# EAGLE design ludusProtoShieldWireless (EAGLE 7.2.0)
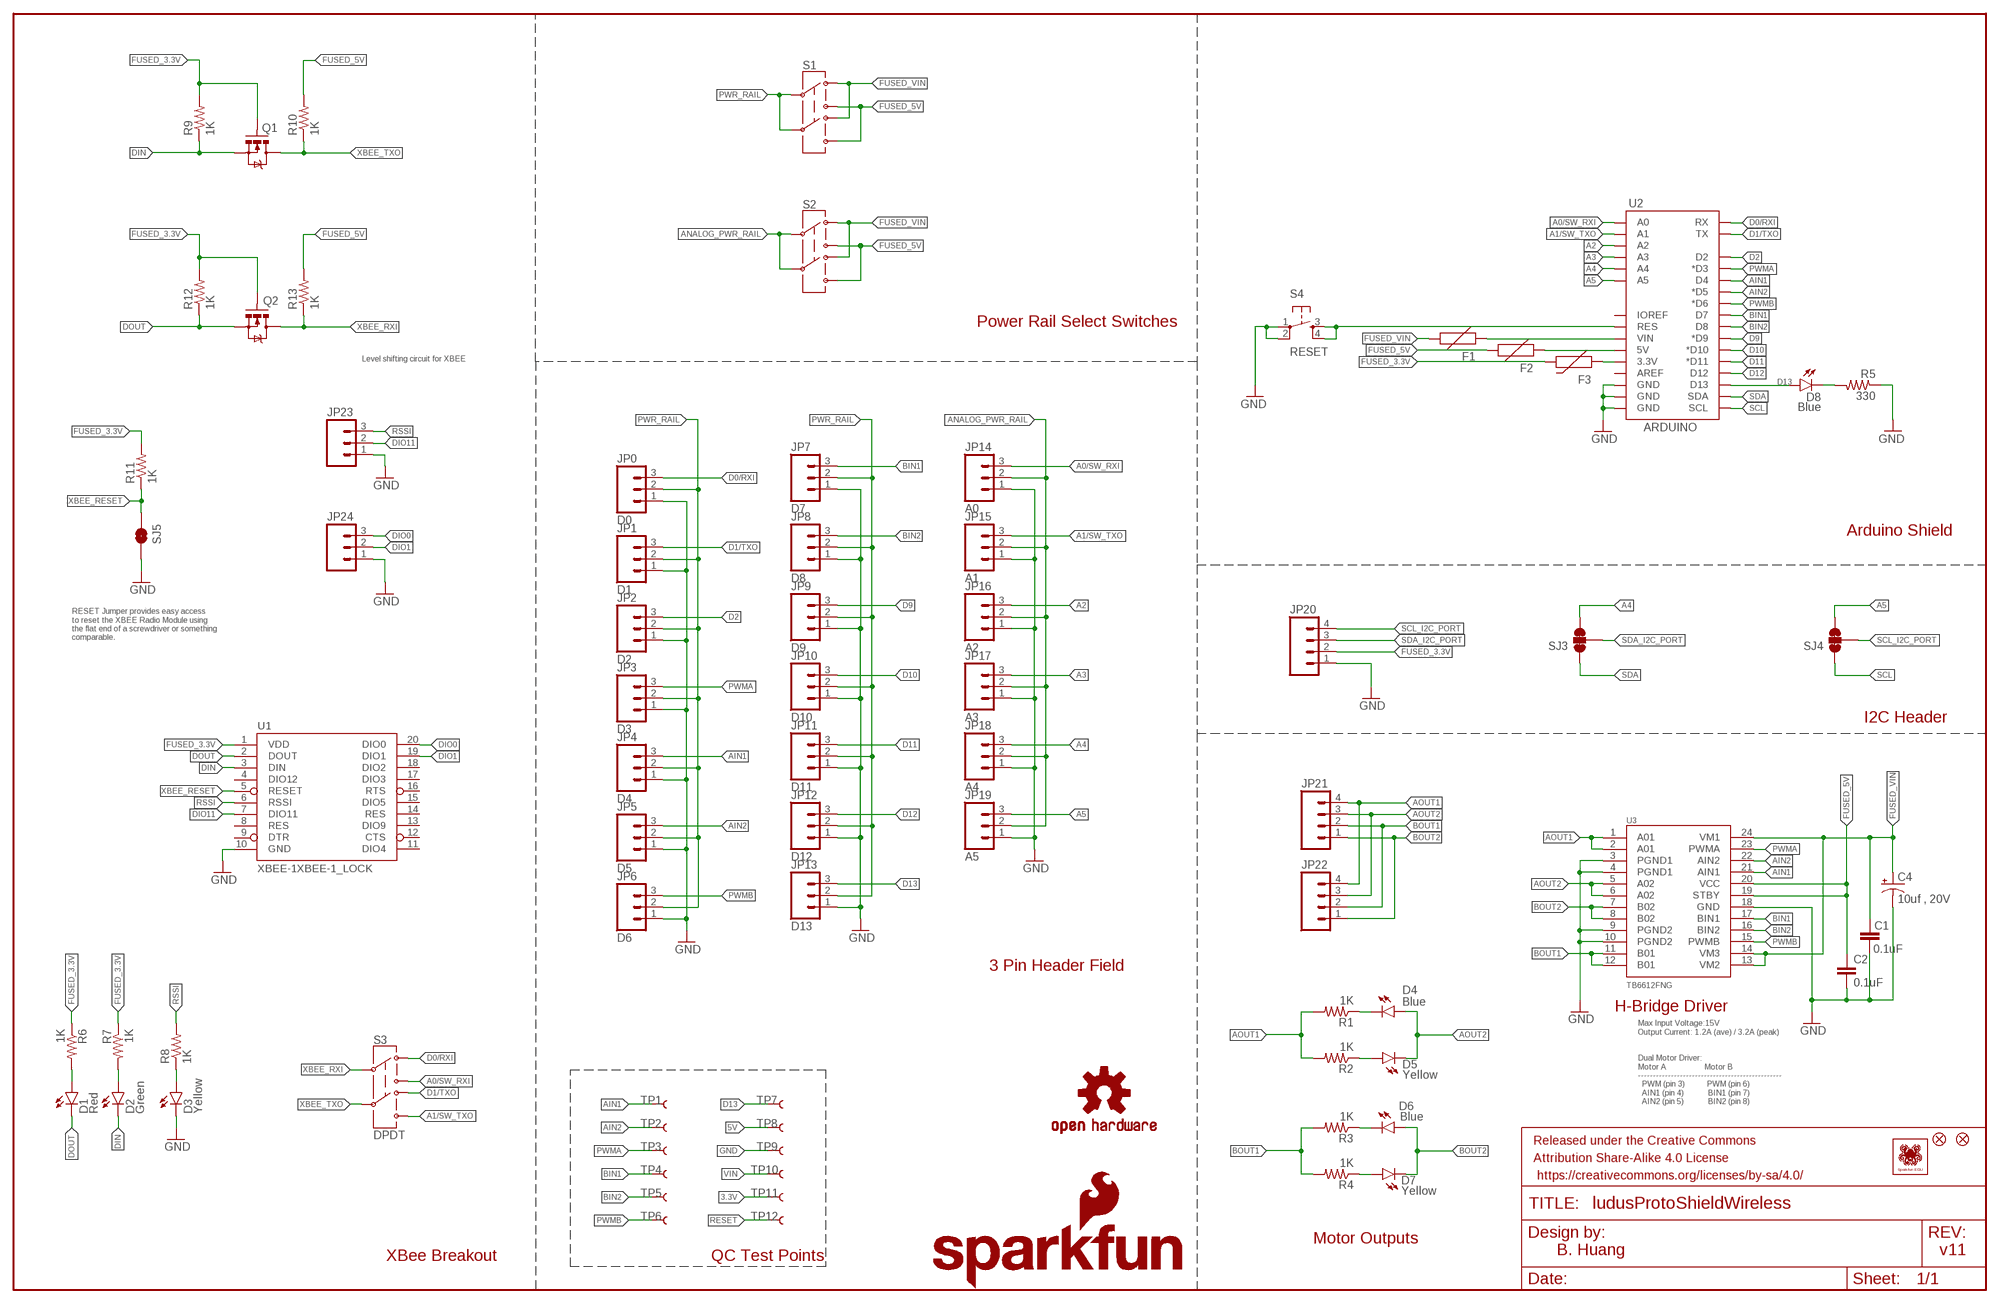
[diagram p0: schematic, sheet 1]

## Parts
C1  0.1uF  0.1UF-25V-5%(0603)  [0603-CAP]
C2  0.1uF  0.1UF-25V-5%(0603)  [0603-CAP]
C4  10uf , 20V  10UF-20V-10%(TANT)  [EIA3528]
D1  Red  LED-RED0603  [LED-0603]
D2  Green  LED-GREEN0603  [LED-0603]
D3  Yellow  LED-YELLOW0603  [LED-0603]
D4  Blue  LED-BLUE0603  [LED-0603]
D5  Yellow  LED-YELLOW0603  [LED-0603]
D6  Blue  LED-BLUE0603  [LED-0603]
D7  Yellow  LED-YELLOW0603  [LED-0603]
D8  Blue  LED-BLUE0603  [LED-0603]
F1  PTCSMD  [PTC-1206]
F2  PTCSMD  [PTC-1206]
F3  PTCSMD  [PTC-1206]
FID1  FIDUCIAL1X2  [FIDUCIAL-1X2]
FID2  FIDUCIAL1X2  [FIDUCIAL-1X2]
FRAME1  FRAME-LEDGER  [CREATIVE_COMMONS]
JP0  D0  M03LOCK  [1X03_LOCK]
JP1  D1  M03LOCK  [1X03_LOCK]
JP2  D2  M03LOCK  [1X03_LOCK]
JP3  D3  M03LOCK  [1X03_LOCK]
JP4  D4  M03LOCK  [1X03_LOCK]
JP5  D5  M03LOCK  [1X03_LOCK]
JP6  D6  M03LOCK  [1X03_LOCK]
JP7  D7  M03LOCK  [1X03_LOCK]
JP8  D8  M03LOCK  [1X03_LOCK]
JP9  D9  M03LOCK  [1X03_LOCK]
JP10  D10  M03LOCK  [1X03_LOCK]
JP11  D11  M03LOCK  [1X03_LOCK]
JP12  D12  M03LOCK  [1X03_LOCK]
JP13  D13  M03LOCK  [1X03_LOCK]
JP14  A0  M03LOCK  [1X03_LOCK]
JP15  A1  M03LOCK  [1X03_LOCK]
JP16  A2  M03LOCK  [1X03_LOCK]
JP17  A3  M03LOCK  [1X03_LOCK]
JP18  A4  M03LOCK  [1X03_LOCK]
JP19  A5  M03LOCK  [1X03_LOCK]
JP20  M04PTH  [1X04]
JP21  M04PTH  [1X04]
JP22  M04LOCK  [1X04_LOCK]
JP23  M031X03_NO_SILK  [1X03_NO_SILK]
JP24  M031X03_NO_SILK  [1X03_NO_SILK]
LOGO1  OSHW-LOGOM  [OSHW-LOGO-M]
LOGO2  SFE_LOGO_NAME_FLAME.1_INCH  [SFE_LOGO_NAME_FLAME_.1]
LOGO3  SFE_LOGO_FLAME.2_INCH  [SFE_LOGO_FLAME_.2]
LOGO4  SFE_LOGO_NAME_FLAME.1_INCH  [SFE_LOGO_NAME_FLAME_.1]
LOGO5  SFE_LOGO_FLAME.2COP  [SFE_LOGO_FLAME_COPPER_.2]
Q1  MOSFET-NCHANNELBSS138  [SOT23-3]
Q2  MOSFET-NCHANNELBSS138  [SOT23-3]
R1  1K  1KOHM-1/10W-1%(0603)  [0603-RES]
R2  1K  1KOHM-1/10W-1%(0603)  [0603-RES]
R3  1K  1KOHM-1/10W-1%(0603)  [0603-RES]
R4  1K  1KOHM-1/10W-1%(0603)  [0603-RES]
R5  330  330OHM1/10W1%(0603)  [0603-RES]
R6  1K  1KOHM-1/10W-1%(0603)  [0603-RES]
R7  1K  1KOHM-1/10W-1%(0603)  [0603-RES]
R8  1K  1KOHM-1/10W-1%(0603)  [0603-RES]
R9  1K  1KOHM-1/10W-1%(0603)  [0603-RES]
R10  1K  1KOHM-1/10W-1%(0603)  [0603-RES]
R11  1K  1KOHM-1/10W-1%(0603)  [0603-RES]
R12  1K  1KOHM-1/10W-1%(0603)  [0603-RES]
R13  1K  1KOHM-1/10W-1%(0603)  [0603-RES]
S1  SWITCH-DPDTAYZ0202  [AYZ0202]
S2  SWITCH-DPDTAYZ0202  [AYZ0202]
S3  DPDT  SWITCH-DPDTAYZ0202  [AYZ0202]
S4  RESET  TAC_SWITCHSMD  [TACTILE-SWITCH-SMD]
SJ3  JUMPER-PAD-3-NC_BY_TRACE  [PAD-JUMPER-3-3OF3_NC_BY_TRACE_YES_SILK_FULL_BOX]
SJ4  JUMPER-PAD-3-NC_BY_TRACE  [PAD-JUMPER-3-3OF3_NC_BY_TRACE_YES_SILK_FULL_BOX]
SJ5  SOLDERJUMPERNO  [SJ_2S-NO]
TP1  TEST-POINT3X5  [PAD.03X.05]
TP2  TEST-POINT3X5  [PAD.03X.05]
TP3  TEST-POINT3X5  [PAD.03X.05]
TP4  TEST-POINT3X5  [PAD.03X.05]
TP5  TEST-POINT3X5  [PAD.03X.05]
TP6  TEST-POINT3X5  [PAD.03X.05]
TP7  TEST-POINT3X5  [PAD.03X.05]
TP8  TEST-POINT3X5  [PAD.03X.05]
TP9  TEST-POINT3X5  [PAD.03X.05]
TP10  TEST-POINT3X5  [PAD.03X.05]
TP11  TEST-POINT3X5  [PAD.03X.05]
TP12  TEST-POINT3X5  [PAD.03X.05]
U1  XBEE-1XBEE-1_LOCK  [XBEE-1_LOCK]
U2  ARDUINO  ARDUINO_R3_SHIELDUNO_R3_SHIELD_NOLABELS_LOCK  [UNO_R3_SHIELD_NOLABELS_LOCK]
U3  TB6612FNG  [SSOP24]
U$1  SFE_LUDUSSFE_LUDUS-M  [SFE_LUDUS-M]

## Nets
3.3V: F3.1 TP11.P$1 U2.3.3V
5V: F2.1 TP8.P$1 U2.5V
A0/SW_RXI: JP14.3 S3.3 U2.A0
A1/SW_TXO: JP15.3 S3.6 U2.A1
A2: JP16.3 U2.A2
A3: JP17.3 U2.A3
A4: JP18.3 SJ3.3 U2.A4
A5: JP19.3 SJ4.3 U2.A5
AIN1: JP4.3 TP1.P$1 U2.D4 U3.21(AIN1)
AIN2: JP5.3 TP2.P$1 U2.D5(*D5) U3.22(AIN2)
ANALOG_PWR_RAIL: JP14.2 JP15.2 JP16.2 JP17.2 JP18.2 JP19.2 S2.2 S2.5
AOUT1: JP21.4 JP22.4 R1.2 R2.2 U3.1(A01) U3.2(A01)
AOUT2: D4.A D5.C JP21.3 JP22.3 U3.5(A02) U3.6(A02)
BIN1: JP7.3 TP4.P$1 U2.D7 U3.17(BIN1)
BIN2: JP8.3 TP5.P$1 U2.D8 U3.16(BIN2)
BOUT1: JP21.2 JP22.2 R3.2 R4.2 U3.11(B01) U3.12(B01)
BOUT2: D6.A D7.C JP21.1 JP22.1 U3.7(B02) U3.8(B02)
D0/RXI: JP0.3 S3.1 U2.RX
D1/TXO: JP1.3 S3.4 U2.TX
D2: JP2.3 U2.D2
D9: JP9.3 U2.D9(*D9)
D10: JP10.3 U2.D10(*D10)
D11: JP11.3 U2.D11(*D11)
D12: JP12.3 U2.D12
D13: D8.A JP13.3 TP7.P$1 U2.D13
DIN: D2.C Q1.2(S) R9.1 U1.3(DIN)
DIO0: JP24.3 U1.20(DIO0)
DIO1: JP24.2 U1.19(DIO1)
DIO11: JP23.2 U1.7(DIO11)
DOUT: D1.C Q2.2(S) R12.1 U1.2(DOUT)
FUSED_3.3V: F3.2 JP20.2 Q1.1(G) Q2.1(G) R6.1 R7.1 R9.2 R11.2 R12.2 U1.1(VDD)
FUSED_5V: C2.1 F2.2 R10.2 R13.2 S1.3 S1.6 S2.3 S2.6 U3.19(STBY) U3.20(VCC)
FUSED_VIN: C1.1 C4.A(+) F1.2 S1.1 S1.4 S2.1 S2.4 U3.13(VM2) U3.14(VM3) U3.24(VM1)
GND: C1.2 C2.2 C4.C(-) D3.C JP0.1 JP1.1 JP2.1 JP3.1 JP4.1 JP5.1 JP6.1 JP7.1 JP8.1 JP9.1 JP10.1 JP11.1 JP12.1 JP13.1 JP14.1 JP15.1 JP16.1 JP17.1 JP18.1 JP19.1 JP20.1 JP23.1 JP24.1 R5.1 S4.1 S4.2 SJ5.2 TP9.P$1 U1.10(GND) U2.GND@0(GND) U2.GND@1(GND) U2.GND@2(GND) U3.3(PGND1) U3.4(PGND1) U3.9(PGND2) U3.10(PGND2) U3.18(GND)
N$1: D8.C R5.2
N$3: D5.A R2.1
N$5: D4.C R1.1
N$8: D7.A R4.1
N$9: D6.C R3.1
N$22: D1.A R6.2
N$43: D2.A R7.2
N$44: D3.A R8.1
PWMA: JP3.3 TP3.P$1 U2.D3(*D3) U3.23(PWMA)
PWMB: JP6.3 TP6.P$1 U2.D6(*D6) U3.15(PWMB)
PWR_RAIL: JP0.2 JP1.2 JP2.2 JP3.2 JP4.2 JP5.2 JP6.2 JP7.2 JP8.2 JP9.2 JP10.2 JP11.2 JP12.2 JP13.2 S1.2 S1.5
RESET: S4.3 S4.4 TP12.P$1 U2.RES
RSSI: JP23.3 R8.2 U1.6(RSSI)
SCL: SJ4.1 U2.SCL
SCL_I2C_PORT: JP20.4 SJ4.2
SDA: SJ3.1 U2.SDA
SDA_I2C_PORT: JP20.3 SJ3.2
VIN: F1.1 TP10.P$1 U2.VIN
XBEE_RESET: R11.1 SJ5.1 U1.5(RESET)
XBEE_RXI: Q2.3(D) R13.1 S3.2
XBEE_TXO: Q1.3(D) R10.1 S3.5
Unconnected: U1.4(DIO12) U1.8(RES) U1.9(DTR) U1.11(DIO4) U1.12(CTS) U1.13(DIO9) U1.14(RES) U1.15(DIO5) U1.16(RTS) U1.17(DIO3) U1.18(DIO2) U2.AREF U2.IOREF

## Notes on the sheet
- Power Rail Select Switches
- Level shifting circuit for XBEE
- Arduino Shield
- RESET Jumper provides easy access 
  to reset the XBEE Radio Module using 
  the flat end of a screwdriver or something
  comparable.
- I2C Header
- 3 Pin Header Field
- H-Bridge Driver
- Max Input Voltage:15V
  Output Current: 1.2A (ave) / 3.2A (peak)
- Dual Motor Driver:
  Motor A                   Motor B
  ------------------------------------------------
    PWM (pin 3)           PWM (pin 6) 
    AIN1 (pin 4)            BIN1 (pin 7)
    AIN2 (pin 5)            BIN2 (pin 8)
- Motor Outputs
- B. Huang | v11
- XBee Breakout | QC Test Points

## Library data of the parts
C1 C2 = SparkFun-Capacitors:0.1UF-25V-5%(0603): CAP-08604; PROD_ID: CAP-08604
C4 = SparkFun-Capacitors:10UF-20V-10%(TANT): CAP-08063; PROD_ID: CAP-08063; VALUE: 10uF
D1 = SparkFun-LED:LED-RED: Assorted Red LEDs LilyPad 1206- DIO-09912 1206- DIO-00809 0603- DIO-00819; PROD_ID: DIO-00819; VALUE: RED
D2 = SparkFun-LED:LED-GREEN: Various green LEDs Green LEDs used in SFE Production 0603- DIO-00821 LARGE- DIO-00862 LILYPAD- DIO-09910; PROD_ID: DIO-00821; VALUE: GREEN
D3 D5 D7 = SparkFun-LED:LED-YELLOW: Yellow SMD LEDs LilyPad 1206- DIO-09909 0603- DIO-09003; PROD_ID: DIO-09003
D4 D6 D8 = SparkFun-LED:LED-BLUE: Blue LEDs for production use Various blue LEDs stocked by SparkFun production 0603 - DIO-08575 Rebel - DIO-09553 1206 - DIO-09911; PROD_ID: DIO-08575; VALUE: BLUE
F1-F3 = SparkFun-PowerIC:PTC: Resettable Fuse PTC Resettable Fuse. Spark Fun Electronics SKU : COM-08357; PROD_ID: RES-11150
FID1 FID2 = SparkFun-Aesthetics:FIDUCIAL: Fiducial Alignment Points Various fiducial points for machine vision alignment.
FRAME1 = SparkFun-Aesthetics:FRAME-LEDGER: Schematic Frame Standard 11x14 US Ledger frame
JP0 JP1-JP19 JP23 JP24 = SparkFun-Connectors:M03: Header 3 Standard 3-pin 0.1" header. Use with straight break away headers (SKU : PRT-00116), right angle break away headers (PRT-00553), swiss pins (PRT-00743), machine pins (PRT-00117), and female headers (PRT-00115). Molex polarized connector foot print use with SKU : PRT-08232 with associated crimp pins and housings.
JP20-JP22 = SparkFun-Connectors:M04: Header 4 Standard 4-pin 0.1" header. Use with straight break away headers (SKU : PRT-00116), right angle break away headers (PRT-00553), swiss pins (PRT-00743), machine pins (PRT-00117), and female headers (PRT-00115). Molex polarized connector foot print use with SKU : PRT-08231 with associated crimp pins and housings. 1MM SMD Version SKU: PRT-10208
LOGO1 = SparkFun-Aesthetics:OSHW-LOGO: Open Source Hardware Logo This logo indicates the piece of hardware it is found on incorporates a OSHW license and/or adheres to the definition of open source hardware found here: http://freedomdefined.org/OSHW
LOGO2 LOGO4 = SparkFun-Aesthetics:SFE_LOGO_NAME_FLAME: SFE Logo, name and flame This is the SparkFun full logo. The logo on the schematic will always be the same size; the package variant is the height of the flame part of the logo. Default layer for the logo on the board is tSilk.
LOGO3 LOGO5 = SparkFun-Aesthetics:SFE_LOGO_FLAME: SFE Logo, flame only This is the SparkFun flame logo. The logo on the schematic will always be the same size; the package variant is the height of the flame. Default layer for the logo on the board is tSilk.
Q1 Q2 = SparkFun-DiscreteSemi:MOSFET-NCHANNEL: Common NMOSFET Parts MFG P/N Store ID Prod ID FDD8780 TRANS-09984 SI7820DN TRANS-11055 FDS6630A IC-08089 2N7002PW TRANS-11151 FQP30N06L COM-10213 TRANS-10060 BSS123LT1G TRANS-08345 BSS138 TRANS-00830 BS170 2N7000; PROD_ID: TRANS-00830; VALUE: 200mA/50V
R1-R4 R6-R13 = SparkFun-Resistors:1KOHM-1/10W-1%(0603): RES-07856; PROD_ID: RES-07856
R5 = SparkFun-Resistors:330OHM1/10W1%(0603): RES-00818; PROD_ID: RES-00818
S1 S2 = SparkFun-Electromechanical:SWITCH-DPDT: DPDT Version of the COM-00597; PROD_ID: SWCH-08179; VALUE: DPDT
S3 = SparkFun-Electromechanical:SWITCH-DPDT: DPDT Version of the COM-00597; PROD_ID: SWCH-08179
S4 = SparkFun-Electromechanical:TAC_SWITCH: Momentary Switch Button commonly used for reset or general input. Spark Fun Electronics SKU : COM-00097 SMT- SWCH-08247; PROD_ID: SWCH-08247; VALUE: TAC_SWITCHSMD
SJ3 SJ4 = SparkFun-Passives:JUMPER-PAD-3-NC_BY_TRACE
SJ5 = SparkFun-Retired:SOLDERJUMPER: Solder Jumper Standard SMD solder jumper. Used to automate production. Two varients : Normally Open and Normally Closed are the same, but have different paste layers. NC will have a large amount of paste and should jumper during reflow.
TP1-TP12 = SparkFun-Passives:TEST-POINT: Bare copper test points for troubleshooting or ICT
U1 = SparkFun-RF:XBEE-1: Xbee module footprints
U2 = SparkFun-Boards:ARDUINO_R3_SHIELD: Shield form compatible with the Arduino Uno R3.
U3 = SparkFun-PowerIC:TB6612FNG: Toshiba 1A dual motor driver IC-09363; PROD_ID: IC-09363
U$1 = SparkFun-Aesthetics:SFE_LUDUS

## Net classes
1 vcc: width 0.305 mm

## Board
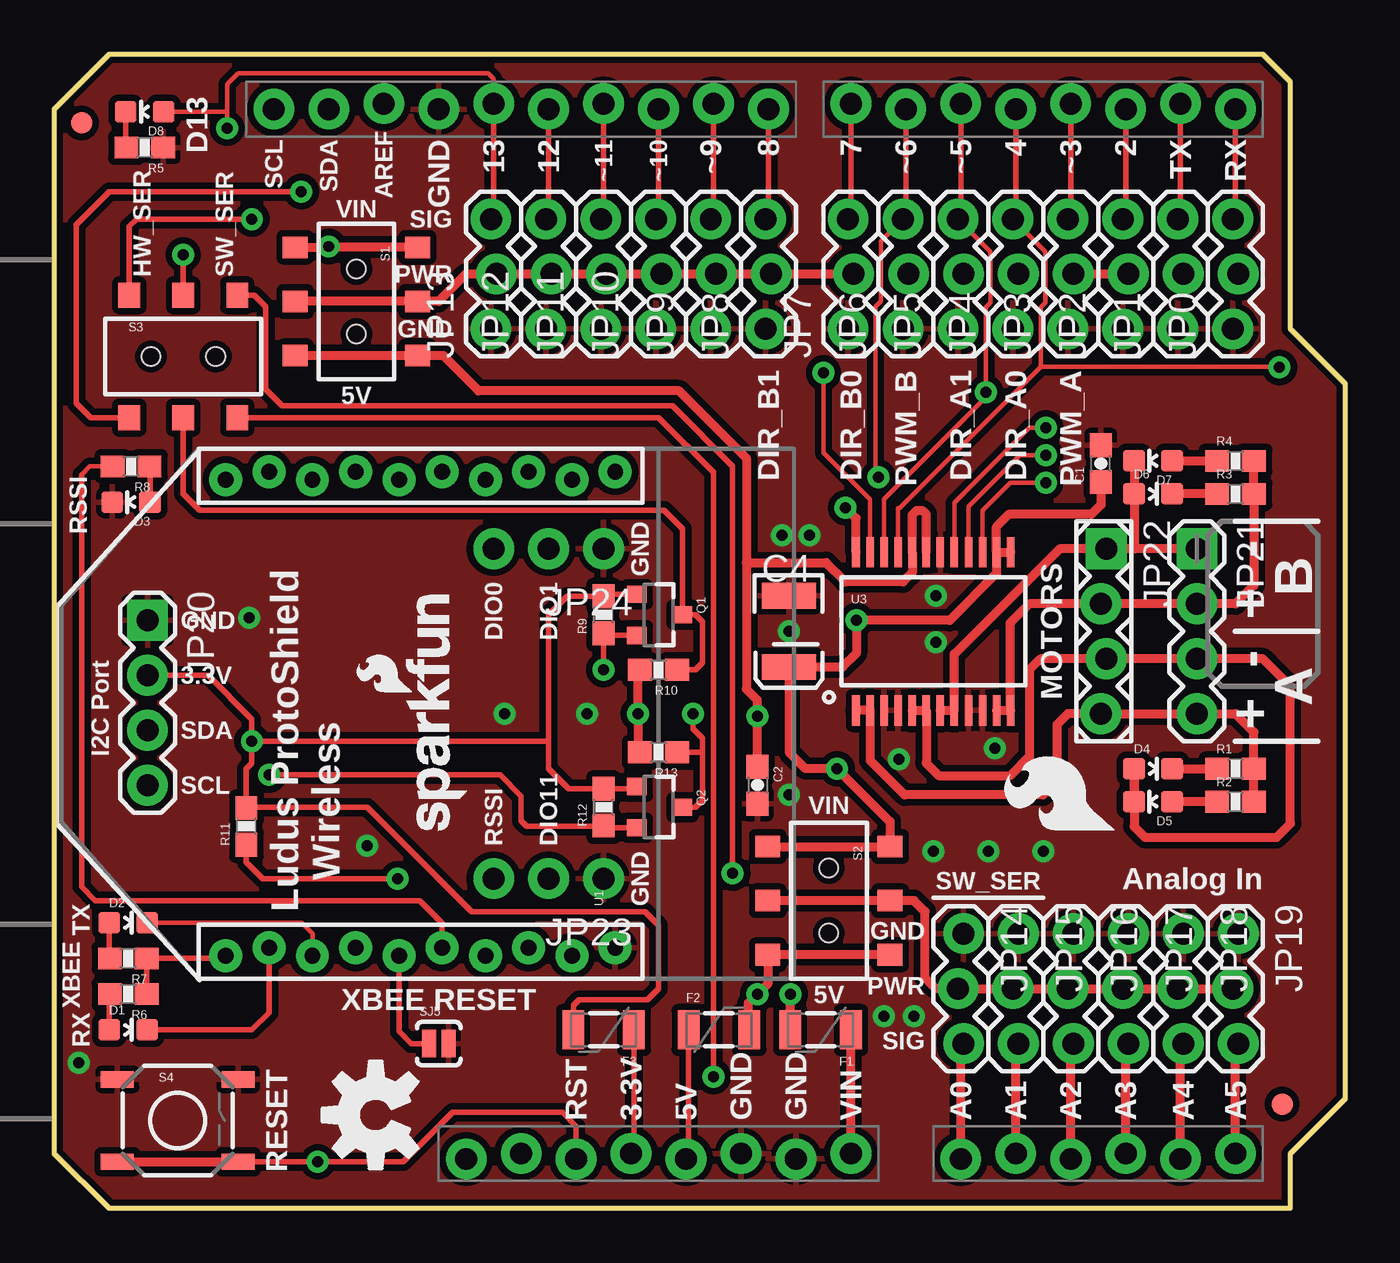
[diagram p1: board, top side]
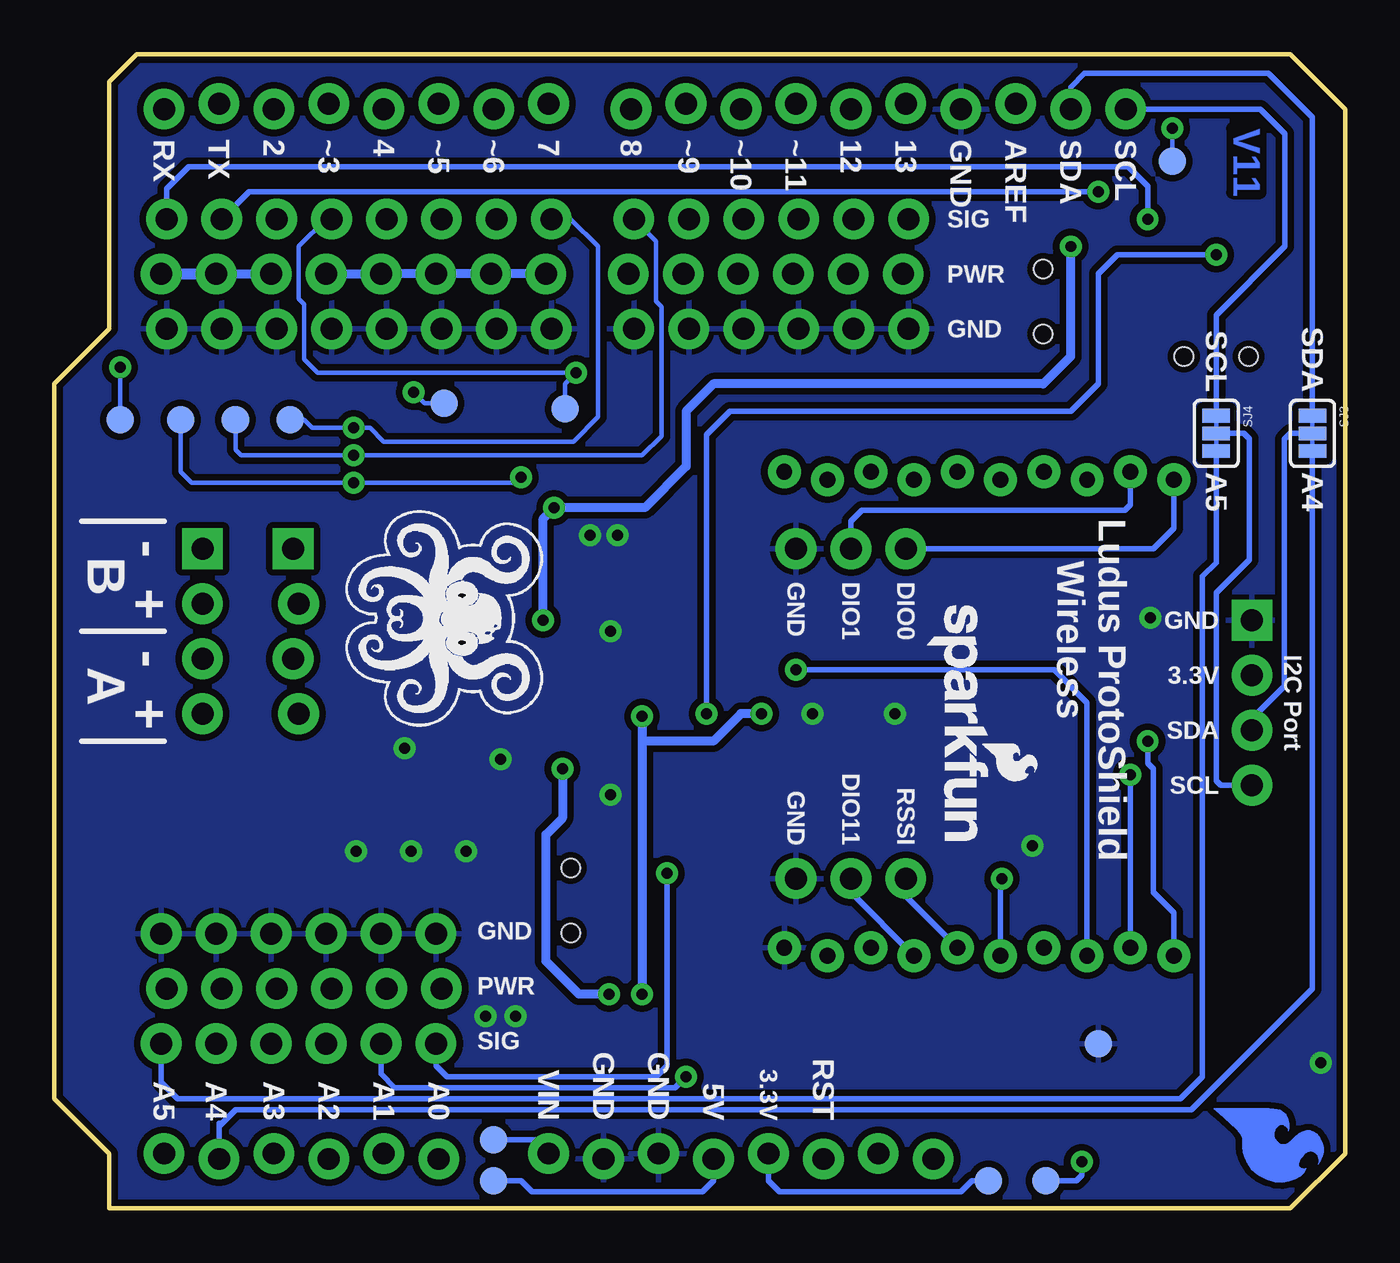
[diagram p2: board, bottom side, seen from below]

Size 59.69 x 53.34 mm. Coordinates in mm from the lower left corner, seen from the top.
Outline: 0,50.8 0,2.54 2.54,0 57.15,0 57.15,2.54 59.69,5.08 59.69,38.1 57.15,40.64 57.15,52.07 55.88,53.34 2.54,53.34 0,50.8
Copper layers (1*16): Top 0.035mm / dielectric 1.5mm / Bottom 0.035mm
Design rules "SparkFun-2-layer": minimum track width 7mil, minimum drill 15mil, track to track 8mil, track to pad 8mil, pad to pad 8mil, via to via 8mil, smd to smd 8mil, copper to edge 8mil, drill to drill 8mil, minimum pad ring 12mil, minimum via ring 10mil, stop-mask expansion 4mil, vias tented up to drill 20mil, thermal gap 10mil

### Footprints (pad centres in the part's own frame; a part is rotated, then mirrored left to right if it is on the bottom)
0603-CAP = smd 1.1 x 1: 1 -0.85,0; 2 0.85,0
EIA3528 = smd 1.2 x 2.5: A 1.65,0; C -1.65,0
LED-0603 = smd 1 x 1: A 0,-0.877; C 0,0.877
PTC-1206 = smd 1 x 1.8: 1 -1.4,0; 2 1.4,0
FIDUCIAL-1X2 = smd 1 x 1: 1 0,0
1X03_LOCK = drill 1.016 pad 1.88: 1 0,0.127; 2 2.54,-0.127; 3 5.08,0.127
1X04 = drill 1.016 pad 1.88 square: 1 0,0 | drill 1.016 pad 1.88: 2 2.54,0; 3 5.08,0; 4 7.62,0
1X04_LOCK = drill 1.016 pad 1.88 square: 1 0,0.127 | drill 1.016 pad 1.88: 2 2.54,-0.127; 3 5.08,0.127; 4 7.62,-0.127
1X03_NO_SILK = drill 1.016 pad 1.88: 1 0,0; 2 2.54,0; 3 5.08,0
SOT23-3 = smd 0.8 x 0.9: 1 -0.95,-1; 2 0.95,-1; 3 0,1.1
0603-RES = smd 1.1 x 1: 1 -0.85,0; 2 0.85,0
AYZ0202 = smd 1 x 1.15: 1 -2.5,2.825; 2 0,2.825; 3 2.5,2.825; 4 -2.5,-2.825; 5 0,-2.825; 6 2.5,-2.825 | hole 0.85: 1.5,0; -1.5,0
TACTILE-SWITCH-SMD = smd 1.524 x 0.762: 1 -2.794,1.905; 2 2.794,1.905; 3 -2.794,-1.905; 4 2.794,-1.905
PAD-JUMPER-3-3OF3_NC_BY_TRACE_YES_SILK_FULL_BOX = smd 0.635 x 1.27: 1 -0.813,0; 2 0,0; 3 0.813,0
SJ_2S-NO = smd 0.635 x 1.27: 1 -0.45,0; 2 0.45,0
PAD.03X.05 = smd 1.27 x 1.27: P$1 0,0
XBEE-1_LOCK = drill 0.737 pad 1.524: 1 -11.178,20; 2 -10.822,18; 3 -11.178,16; 4 -10.822,14; 5 -11.178,12; 6 -10.822,10; 7 -11.178,8; 8 -10.822,6; 9 -11.178,4; 10 -10.822,2; 11 11.178,2; 12 10.822,4; 13 11.178,6; 14 10.822,8; 15 11.178,10; 16 10.822,12; 17 11.178,14; 18 10.822,16; 19 11.178,18; 20 10.822,20
UNO_R3_SHIELD_NOLABELS_LOCK = drill 1.016 pad 1.88: 3.3V 50.8,26.67; 5V 51.054,29.21; A0 51.054,41.91; A1 50.8,44.45; A2 51.054,46.99; A3 50.8,49.53; A4 51.054,52.07; A5 50.8,54.61; AREF 2.286,15.24; D2 2.54,49.53; D3 2.286,46.99; D4 2.54,44.45; D5 2.286,41.91; D6 2.54,39.37; D7 2.286,36.83; D8 2.54,33.02; D9 2.286,30.48; D10 2.54,27.94; D11 2.286,25.4; D12 2.54,22.86; D13 2.286,20.32; GND@0 50.8,31.75; GND@1 51.054,34.29; GND@2 2.54,17.78; IOREF 50.8,21.59; NC 51.054,19.05; RES 51.054,24.13; RX 2.54,54.61; SCL 2.54,10.16; SDA 2.54,12.7; TX 2.286,52.07; VIN 50.8,36.83
SSOP24 = smd 0.348 x 1.397: 1 -3.575,-3.656; 2 -2.925,-3.656; 3 -2.275,-3.656; 4 -1.625,-3.656; 5 -0.975,-3.656; 6 -0.325,-3.656; 7 0.325,-3.656; 8 0.975,-3.656; 9 1.625,-3.656; 10 2.275,-3.656; 11 2.925,-3.656; 12 3.575,-3.656; 13 3.575,3.656; 14 2.925,3.656; 15 2.275,3.656; 16 1.625,3.656; 17 0.975,3.656; 18 0.325,3.656; 19 -0.325,3.656; 20 -0.975,3.656; 21 -1.625,3.656; 22 -2.275,3.656; 23 -2.925,3.656; 24 -3.575,3.656

### Placement (x,y rotation side)
C1  48.39,34.42 90 top
C2  32.51,19.56 270 top
C4  33.97,26.67 270 top
D1  3.43,8.26 270 top
D2  3.43,13.21 270 top
D3  3.56,32.64 90 top
D4  50.8,20.32 270 top
D5  50.8,18.8 90 top
D6  50.8,33.02 270 top
D7  50.8,34.54 90 top
D8  4.19,50.67 90 top
F1  35.43,8.26 180 top
F2  30.73,8.26 0 top
F3  25.4,8.26 180 top
FID1  1.27,50.16 0 top
FID2  56.77,4.83 0 top
FRAME1  -3.81,-10.16 0 top  (outside the outline)
JP0  54.61,40.64 90 top
JP1  52.07,40.64 90 top
JP2  49.53,40.64 90 top
JP3  46.99,40.64 90 top
JP4  44.45,40.64 90 top
JP5  41.91,40.64 90 top
JP6  39.37,40.64 90 top
JP7  36.83,40.64 90 top
JP8  33.02,40.64 90 top
JP9  30.48,40.64 90 top
JP10  27.94,40.64 90 top
JP11  25.4,40.64 90 top
JP12  22.86,40.64 90 top
JP13  20.32,40.64 90 top
JP14  41.91,12.7 270 top
JP15  44.45,12.7 270 top
JP16  46.99,12.7 270 top
JP17  49.53,12.7 270 top
JP18  52.07,12.7 270 top
JP19  54.61,12.7 270 top
JP20  4.32,27.18 270 top
JP21  52.83,30.48 270 top
JP22  48.51,30.48 270 top
JP23  25.4,15.24 180 top
JP24  25.4,30.48 180 top
LOGO1  14.86,4.32 90 top
LOGO2  19.18,17.02 90 top
LOGO3  49.28,17.14 90 top
LOGO4  19.43,28.32 270 bottom
LOGO5  6.35,4.95 270 bottom
Q1  27.94,27.43 270 top
Q2  27.94,18.54 270 top
R1  54.61,20.32 0 top
R2  54.61,18.8 0 top
R3  54.61,33.02 0 top
R4  54.61,34.54 0 top
R5  4.19,49.02 180 top
R6  3.43,9.91 180 top
R7  3.43,11.56 180 top
R8  3.56,34.29 180 top
R9  25.4,27.43 90 top
R10  27.94,24.89 180 top
R11  8.89,17.65 90 top
R12  25.4,18.54 90 top
R13  27.94,21.08 180 top
S1  13.97,41.91 270 top
S2  35.81,14.22 270 top
S3  5.97,39.37 0 top
S4  5.71,4.06 0 top
SJ3  1.52,35.81 270 bottom
SJ4  5.97,35.81 270 bottom
SJ5  17.78,7.62 0 top
TP1  56.64,36.45 90 bottom
TP2  41.66,37.21 90 bottom
TP3  36.07,36.96 90 bottom
TP4  48.77,36.45 90 bottom
TP5  51.31,36.45 90 bottom
TP6  53.85,36.45 180 bottom
TP7  8,48.39 180 bottom
TP8  39.37,1.27 90 bottom
TP9  11.43,7.62 0 bottom
TP10  39.37,3.17 0 bottom
TP11  16.51,1.27 0 bottom
TP12  13.84,1.27 0 bottom
U1  27.94,22.86 90 top
U2  0,53.34 270 top
U3  40.64,26.67 0 top
U$1  41.78,27.18 270 bottom

### Tracks (layer width: path | path; a pad name or v marks a point on that pad's centre or on a via)
3.3V
  Top 0.254: F3.1 26.8,2.67 U2.3.3V
  Bottom 0.254: TP11.P$1 17.27,1.27 17.78,0.76 26.16,0.76 26.67,1.27 U2.3.3V
5V
  Top 0.254: F2.1 29.33,2.41 U2.5V
  Bottom 0.254: TP8.P$1 38.1,1.27 37.59,0.76 29.72,0.76 29.21,1.27 U2.5V
A0/SW_RXI  (via drill 0.51)
  Top 0.254: v31.37,15.49 31.37,34.29 28.57,37.08 10.54,37.08 9.78,37.85 9.78,41.66 9.24,42.2 S3.3
  Top 0.406: U2.A0 41.91,7.49 JP14.3
  Bottom 0.254: JP14.3 42.04,6.6 41.53,6.1 31.88,6.1 31.37,6.6 v31.37,15.49
A1/SW_TXO  (via drill 0.51)
  Top 0.254: S3.6 27.94,36.55 30.45,34.04 30.48,34.04 v30.48,6.1
  Top 0.406: U2.A1 44.45,7.49 JP15.3
  Bottom 0.254: v30.48,6.1 30.99,5.59 43.94,5.59 44.58,6.22 JP15.3
A2
  Top 0.406: U2.A2 46.99,7.49 JP16.3
A3
  Top 0.406: U2.A3 49.53,7.49 JP17.3
A4
  Top 0.406: U2.A4 52.07,7.49 JP18.3
  Bottom 0.254: U2.A4 52.07,3.81 | 52.07,3.81 52.07,3.94 | 52.07,3.81 51.31,4.57 7.11,4.57 2.67,9.02 1.78,9.91 1.52,10.16 SJ3.3
A5
  Top 0.406: U2.A5 54.61,7.49 JP19.3
  Bottom 0.254: JP19.3 54.74,5.84 53.98,5.08 7.62,5.08 6.6,6.1 6.6,29.21 5.97,29.84 SJ4.3
AIN1  (via drill 0.51)
  Top 0.203: U3.21 39.02,32.35 39.07,32.35 45.61,38.89 | 45.61,38.89 45.61,41.64 45.83,41.86 45.83,44.22 JP4.3 | 45.61,38.89 56.61,38.89 v56.64,38.86
  Top 0.254: U2.D4 44.45,45.85 JP4.3
  Bottom 0.203: v56.64,38.86 TP1.P$1
AIN2  (via drill 0.51)
  Top 0.203: U3.22 38.37,32.78 43.07,37.48 v43.07,37.72 43.07,41.64 43.29,41.86 43.29,44.22 JP5.3
  Top 0.254: U2.D5 41.91,45.85 JP5.3
  Bottom 0.203: v43.07,37.72 42.56,37.21 TP2.P$1
  Bottom 0.254: 42.04,50.93 U2.D5
ANALOG_PWR_RAIL
  Top 0.406: JP19.2 JP18.2 JP17.2 JP16.2 JP15.2 JP14.2 40.77,10.16 40.26,10.67 40.26,13.72 39.75,14.22 S2.2 S2.5
AOUT1
  Top 0.406: R2.2 R1.2 55.46,22.01 54.61,22.86 JP21.4 JP22.4 46.86,22.86 46.35,22.35 46.35,19.75 45.72,19.11 39.31,19.11 37.72,20.7 U3.2 U3.1
AOUT2
  Top 0.406: D5.C D4.A 49.92,17.64 50.42,17.14 56.52,17.14 57.15,17.78 57.15,24.13 55.88,25.4 JP21.3 JP22.3 45.59,25.4 45.09,24.89 45.09,20.89 44.2,20 40.89,20 40.31,20.58 U3.6 U3.5
BIN1  (via drill 0.51)
  Top 0.203: v45.85,36.07 45.09,36.07 41.62,32.6 U3.17
  Top 0.254: U2.D7 36.83,45.85 JP7.3
  Bottom 0.203: TP4.P$1 48.13,36.45 47.75,36.07 v45.85,36.07 45.09,36.07 44.45,35.43 35.69,35.43 34.54,36.58 34.54,44.45 35.81,45.72 JP7.3
BIN2  (via drill 0.51)
  Top 0.203: U3.16 42.27,32.42 44.64,34.8 v45.85,34.8
  Top 0.254: U2.D8 33.02,45.85 JP8.3
  Bottom 0.203: TP5.P$1 51.31,35.05 51.05,34.8 v45.85,34.8 32.51,34.8 31.62,35.69 31.62,41.66 31.88,41.91 31.88,44.7 JP8.3
BOUT1
  Top 0.406: R4.2 R3.2 55.46,28.79 54.61,27.94 JP21.2 JP22.2 45.09,27.94 44.22,27.07 44.22,27.03 | U3.11 U3.12 44.22,27.03 | 44.22,27.03 44.2,27.05
BOUT2
  Top 0.406: U3.7 U3.8 41.62,25.61 46.48,30.48 JP22.1 49.92,30.48 | D7.C D6.A 49.92,30.48 | JP21.1 49.92,30.48
D0/RXI  (via drill 0.51)
  Top 0.254: v9.14,45.72 3.81,45.72 3.47,45.38 S3.1 | U2.RX 54.61,45.85 JP0.3
  Bottom 0.254: JP0.3 54.48,47.12 53.47,48.13 10.03,48.13 9.14,47.24 v9.14,45.72
D1/TXO  (via drill 0.51)
  Top 0.254: 2.57,36.55 S3.4 1.68,36.55 1.02,37.21 1.02,45.47 2.54,46.99 v11.43,46.99 | U2.TX 52.07,45.85 JP1.3
  Bottom 0.254: JP1.3 50.67,46.99 v11.43,46.99
D2
  Top 0.254: U2.D2 49.53,45.85 JP2.3
D9
  Top 0.203: 30.48,45.85 JP9.3
  Top 0.254: U2.D9 30.48,45.85
D10
  Top 0.254: U2.D10 27.94,45.85 JP10.3
D11
  Top 0.254: U2.D11 25.4,45.85 JP11.3
D12
  Top 0.254: U2.D12 22.86,45.85 JP12.3
D13  (via drill 0.51)
  Top 0.203: U2.D13 20.32,52.2 20.07,52.45 8.51,52.45 8,51.94 8,50.67 | v8,49.91 8,50.67 | D8.A 8,50.67
  Top 0.254: U2.D13 20.32,45.85 JP13.3
  Bottom 0.203: TP7.P$1 v8,49.91
DIN  (via drill 0.51)
  Top 0.203: U1.3 11.94,12.7 11.43,13.21 D2.C
  Top 0.254: Q1.2 25.5,26.48 R9.1 v25.4,24.89
  Bottom 0.254: U1.3 11.94,23.37 13.46,24.89 v25.4,24.89
DIO0
  Bottom 0.254: U1.20 7.94,31.43 8.89,30.48 JP24.3
DIO1
  Bottom 0.254: U1.19 9.94,32.51 10.19,32.26 22.35,32.26 22.86,31.75 JP24.2
DIO11
  Bottom 0.254: U1.7 22.86,14.6 JP23.2
DOUT  (via drill 0.51)
  Top 0.254: Q2.2 25.5,17.59 R12.1 25.36,17.65 21.84,17.65 21.59,17.91 21.59,19.05 20.61,20.03 v9.94,20.03 | U1.2 9.94,9.05 9.14,8.26 D1.C
  Bottom 0.254: U1.2 v9.94,20.03 9.91,20.07
FUSED_3.3V  (via drill 0.51)
  Top 0.254: Q1.1 25.5,28.38 R9.2 23.71,28.28 22.86,27.43 22.86,21.59 | Q2.1 26.84,19.39 R12.2 23.79,19.39 22.86,20.32 22.86,21.59 | v9.14,21.59 22.86,21.59 | JP20.2 7.11,24.64 9.14,22.61 v9.14,21.59 | F3.2 24,9.39 24.26,9.65 27.43,9.65 27.94,10.16 27.94,13.08 27.3,13.72 19.3,13.72 14.48,18.54 8.93,18.54 R11.2 8.89,20.32 9.14,20.57 v9.14,21.59 | R6.1 R7.1 7.82,11.56 U1.1 | 9.18,21.55 v9.14,21.59
  Bottom 0.254: U1.1 7.94,13.65 8.89,14.61 8.89,20.32 9.14,20.57 v9.14,21.59
FUSED_5V  (via drill 0.51)
  Top 0.254: 26.99,21.18 R13.2 | 26.99,24.79 R10.2
  Top 0.406: U3.19 40.31,32.08 40.13,32.26 39.88,32.26 39.66,32.05 U3.20 39.66,29.38 39.24,28.96 36.58,28.96 35.69,29.84 32,29.84 | 26.99,21.18 v26.99,22.86 26.99,24.79 | 32,29.84 32,34.67 28.89,37.78 19.62,37.78 17.99,39.41 S1.3 S1.6 | F2.2 32.09,8.3 32.09,9.49 v32.51,9.91 32.99,10.38 S2.6 S2.3 | C2.1 v32.51,22.73 32.51,23.5 32,24 32,29.84
  Bottom 0.406: v26.99,22.86 27.94,22.86 29.21,21.59 32.51,21.59 | v32.51,22.73 32.51,21.59 | 32.51,21.59 v32.51,9.91
FUSED_VIN  (via drill 0.51)
  Top 0.406: U3.24 37.06,31.9 v36.58,32.38 | U3.14 43.56,29.34 41.4,27.18 v37.08,27.18 37.08,25.65 36.45,25.02 C4.A 33.97,21.08 34.73,20.32 v36.2,20.32 38.64,17.88 S2.1 S2.4 | C1.1 48.39,32.51 47.94,32.07 44.13,32.07 43.56,31.5 U3.14 | F1.2 v34.03,9.9 v34.04,9.91 | S1.4 12.66,44.41 v12.7,44.45 12.74,44.41 S1.1 | 34.01,9.93 v34.04,9.91 | 33.98,9.96 v34.04,9.91 | U3.14 U3.13
  Bottom 0.406: v37.08,27.18 37.08,31.88 v36.58,32.38 32.38,32.38 30.48,34.29 30.48,36.83 29.21,38.1 13.97,38.1 12.7,39.37 v12.7,44.45 | v34.04,9.91 35.43,9.91 36.96,11.43 36.96,17.27 36.2,18.03 v36.2,20.32
GND  (via drill 0.51)
  other vias: 39.05,20.76 43.18,16.51 45.72,16.51 40.64,16.51 33.66,31.11 34.92,31.11 33.97,26.67 43.5,21.27 9.02,27.3 24.64,22.86 20.83,22.86 14.48,16.76 33.97,19.11 38.35,8.89 39.75,8.89 40.77,28.32 40.77,26.16 1.14,6.73
  pour Top (isolate 0.305): 0,53.34 0,0 59.69,0 59.69,53.34
  pour Bottom (isolate 0.305): 0,0 59.69,0 59.69,53.34 0,53.34
N$1
  Top 0.203: D8.C 3.31,50.7
  Top 0.254: D8.C 3.31,49.05 R5.2
N$3
  Top 0.406: R2.1 D5.A
N$5
  Top 0.406: D4.C R1.1
N$8
  Top 0.406: D7.A R4.1
N$9
  Top 0.406: R3.1 D6.C
N$22
  Top 0.254: D1.A 2.55,9.88 R6.2
N$43
  Top 0.254: D2.A 2.55,11.58 R7.2
N$44
  Top 0.254: D3.A 4.43,34.26 R8.1
PWMA  (via drill 0.51)
  Top 0.203: U3.23 37.72,32.77 35.56,34.92 v35.56,38.61
  Top 0.254: U2.D3 46.99,45.85 JP3.3
  Bottom 0.203: TP3.P$1 36.07,38.1 v35.56,38.61 47.5,38.61 48.13,39.24 48.13,41.78 48.39,42.04 48.39,44.45 47.12,45.72 JP3.3
PWMB  (via drill 0.51)
  Top 0.203: 39.37,45.85 JP6.3 38.23,44.7 38.23,41.91 37.97,41.66 37.97,34.04 38.1,33.91 v38.1,33.78 | v45.85,33.53 44.2,33.53 42.91,32.25 U3.15
  Top 0.254: U2.D6 39.37,45.85
  Bottom 0.203: TP6.P$1 53.85,34.04 53.34,33.53 v45.85,33.53 38.35,33.53 v38.1,33.78
PWR_RAIL
  Top 0.406: JP7.2 JP8.2 JP9.2 JP10.2 JP11.2 JP12.2 JP13.2 19.05,43.18 17.78,41.91 S1.2 S1.5 | JP3.2 JP2.2
  Bottom 0.406: JP3.2 JP4.2 JP5.2 JP6.2 JP7.2 | JP1.2 JP2.2
  Bottom 0.508: JP0.2 JP1.2
RESET  (via drill 0.51)
  Top 0.254: U2.RES 24.13,3.81 23.5,4.45 18.41,4.45 16.13,2.16 v12.19,2.16 S4.4
  Top 0.406: S4.3 S4.4
  Bottom 0.254: v12.19,2.16 12.19,1.52 12.45,1.27 TP12.P$1
RSSI
  Top 0.203: R8.2 1.65,34.29 1.27,33.91
  Top 0.254: 1.27,33.91 1.27,14.86 1.91,14.22 16.89,14.22 17.94,13.18 U1.6
  Bottom 0.254: U1.6 20.32,14.42 JP23.3
SCL
  Bottom 0.254: U2.SCL 3.94,50.8 2.79,49.66 2.79,44.45 5.97,41.27 SJ4.1
SCL_I2C_PORT
  Bottom 0.254: JP20.4 5.77,19.56 5.97,19.76 5.97,28.45 4.45,29.97 4.45,35.56 4.7,35.81 SJ4.2
SDA
  Bottom 0.254: U2.SDA 12.7,51.82 12.06,52.45 3.56,52.45 2.22,51.12 1.78,50.67 1.52,50.42 SJ3.1
SDA_I2C_PORT
  Bottom 0.254: JP20.3 4.32,22.63 2.82,24.13 2.82,35.53 2.54,35.81 SJ3.2
VIN
  Top 0.406: U2.VIN F1.1
  Bottom 0.254: TP10.P$1 37.47,3.17 U2.VIN
XBEE_RESET  (via drill 0.51)
  Top 0.254: U1.5 15.94,8.19 16.51,7.62 SJ5.1 | v15.88,15.24 9.65,15.24 8.89,16 R11.1
  Bottom 0.254: U1.5 15.94,15.18 v15.88,15.24
XBEE_RXI  (via drill 0.51)
  Top 0.254: Q2.3 29.65,18.54 29.97,18.86 29.97,21.08 | 29.97,21.08 R13.1 | v29.53,22.86 29.53,22.16 29.97,21.72 29.97,21.08 | S3.2 v5.97,44.07
  Bottom 0.254: v29.53,22.86 29.53,35.75 28.45,36.83 12.7,36.83 11.43,38.1 11.43,43.18 10.54,44.07 v5.97,44.07
XBEE_TXO
  Top 0.254: R10.1 29.65,24.89 29.97,25.21 29.97,27.11 29.65,27.43 Q1.3 29.04,31.41 28.19,32.26 6.73,32.26 5.97,33.02 S3.5

### Text on the board
Bottom: V11
tPlace: AREF | D13 | SCL | SDA | GND | 13 | 12 | ~11 | ~10 | ~9 | 8 | 7 | ~6 | ~5 | 4 | ~3 | 2 | TX | RX | VIN | SIG | HW_SER | SW_SER | PWR | GND | DIR_B1 | DIR_B0 | PWM_B | DIR_A1 | DIR_A0 | PWM_A | 5V | RSSI | GND | - | DIO0 | DIO1 | B | B | + | GND | MOTORS | 3.3V | - | A | I2C Port | + | SDA | SCL | VIN | RSSI | DIO11 | GND | SW_SER | Analog In | Ludus ProtoShield / Wireless | TX | GND | XBEE | 5V | PWR | XBEE RESET | RX | SIG | RESET | RST | 3.3V | 5V | GND | GND | VIN | A0 | A1 | A2 | A3 | A4 | A5
bPlace: SCL | SDA | AREF | GND | 13 | 12 | ~11 | ~10 | ~9 | 8 | 7 | ~6 | ~5 | 4 | ~3 | 2 | TX | RX | SIG | PWR | GND | SDA | SCL | A4 | A5 | Ludus ProtoShield / Wireless | - | DIO0 | DIO1 | GND | B | + | GND | 3.3V | - | A | I2C Port | + | SDA | SCL | RSSI | DIO11 | GND | GND | PWR | SIG | RST | 3.3V | 5V | GND | GND | VIN | A0 | A1 | A2 | A3 | A4 | A5
tValues: L298P013TR
Measures: All measurements are in inches.
tDocu: B. Huang